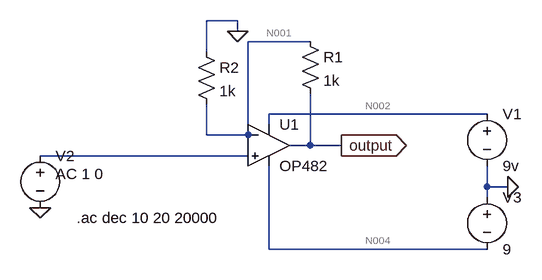
[diagram p0: schematic simple_op_amp.asc]
simple_op_amp.asc, the LTspice schematic file:
Version 4.1
SHEET 1 880 680
WIRE -16 0 -64 0
WIRE -16 16 -16 0
WIRE 96 32 0 32
WIRE -64 48 -64 0
WIRE 368 144 32 144
WIRE 32 160 32 144
WIRE -64 176 -64 128
WIRE 0 176 0 32
WIRE 0 176 -64 176
WIRE 96 192 96 112
WIRE 96 192 64 192
WIRE 144 192 96 192
WIRE 0 208 -320 208
WIRE 368 256 368 224
WIRE 400 256 368 256
WIRE 368 272 368 256
WIRE 32 352 32 224
WIRE 368 352 32 352
FLAG -320 288 0
FLAG -16 16 0
FLAG 144 192 output
IOPIN 144 192 Out
FLAG 400 256 0
SYMBOL voltage 368 128 R0
WINDOW 123 0 0 Left 0
WINDOW 39 0 0 Left 0
SYMATTR InstName V1
SYMATTR Value 9v
SYMBOL OpAmps\\OP482 32 128 R0
SYMATTR InstName U1
SYMBOL voltage -320 192 R0
WINDOW 123 24 44 Left 2
WINDOW 39 0 0 Left 0
SYMATTR Value2 AC 1 0
SYMATTR InstName V2
SYMATTR Value ""
SYMBOL res -80 32 R0
SYMATTR InstName R2
SYMATTR Value 1k
SYMBOL res 80 16 R0
SYMATTR InstName R1
SYMATTR Value 1k
SYMBOL voltage 368 256 R0
WINDOW 123 0 0 Left 0
WINDOW 39 0 0 Left 0
SYMATTR InstName V3
SYMATTR Value 9
TEXT -264 304 Left 2 !.ac dec 10 20 20000

The netlist it stands for:
* simple_op_amp.asc
V1 N002 0 9v
X§U1 N003 N001 N002 N004 output OP482  ; pins In+ In- V+ V- OUT
V2 N003 0 AC 1 0
R2 0 N001 1k
R1 N001 output 1k
V3 0 N004 9
.ac dec 10 20 20000
.backanno
.end

* Results of the author's LTspice run, read from the files saved beside the schematic
* Operating Point, zero values left out:
*   V(n001) = -259 µV
*   V(n002) = 9 V
*   V(n004) = -9 V
*   V(output) = -517.9 µV
*   I(R1) = 259 nA
*   I(R2) = 259 nA
*   I(V1) = -1.004 mA
*   I(V3) = -1.004 mA
*   Ix(u1:2) = -3.524 pA
*   Ix(u1:3) = 1.004 mA
*   Ix(u1:4) = -1.004 mA
*   Ix(u1:5) = 259 nA